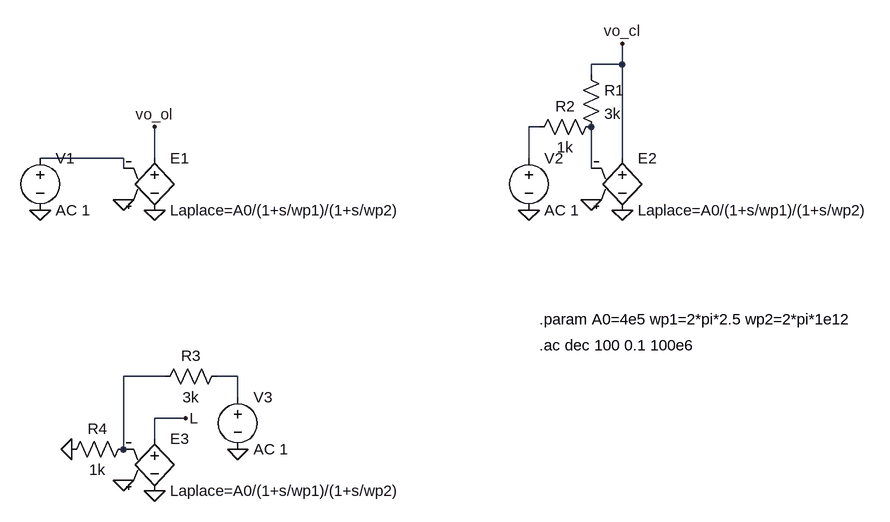
[diagram p0: schematic Draft5.asc]
Draft5.asc, the LTspice schematic file:
Version 4
SHEET 1 1644 896
WIRE 1232 224 1232 192
WIRE 1232 224 1184 224
WIRE 1184 240 1184 224
WIRE 1104 320 1088 320
WIRE 464 368 336 368
WIRE 512 368 512 320
WIRE 1088 368 1088 320
WIRE 1232 368 1232 224
WIRE 464 384 464 368
WIRE 1184 384 1184 320
WIRE 528 704 464 704
WIRE 640 704 608 704
WIRE 640 736 640 704
WIRE 560 768 512 768
WIRE 512 800 512 768
WIRE 464 816 464 704
FLAG 336 448 0
FLAG 464 432 0
FLAG 512 448 0
FLAG 512 320 vo_ol
FLAG 1232 192 vo_cl
FLAG 1088 448 0
FLAG 1184 432 0
FLAG 1232 448 0
FLAG 512 880 0
FLAG 464 864 0
FLAG 384 816 0
FLAG 560 768 L
FLAG 640 816 0
SYMBOL voltage 336 352 R0
SYMATTR InstName V1
SYMATTR Value AC 1
SYMBOL voltage 1088 352 R0
SYMATTR InstName V2
SYMATTR Value AC 1
SYMBOL voltage 640 720 R0
SYMATTR InstName V3
SYMATTR Value AC 1
SYMBOL e2 512 352 R0
SYMATTR InstName E1
SYMATTR Value Laplace=A0/(1+s/wp1)/(1+s/wp2)
SYMBOL e2 1232 352 R0
SYMATTR InstName E2
SYMATTR Value Laplace=A0/(1+s/wp1)/(1+s/wp2)
SYMBOL e2 512 784 R0
SYMATTR InstName E3
SYMATTR Value Laplace=A0/(1+s/wp1)/(1+s/wp2)
SYMBOL Res 1200 304 R90
WINDOW 0 0 56 VBottom 2
WINDOW 3 32 56 VTop 2
SYMATTR InstName R2
SYMATTR Value 1k
SYMBOL Res 1168 224 R0
SYMATTR InstName R1
SYMATTR Value 3k
SYMBOL Res 480 800 R90
WINDOW 0 0 56 VBottom 2
WINDOW 3 32 56 VTop 2
SYMATTR InstName R4
SYMATTR Value 1k
SYMBOL Res 624 688 R90
WINDOW 0 0 56 VBottom 2
WINDOW 3 32 56 VTop 2
SYMATTR InstName R3
SYMATTR Value 3k
TEXT 1104 616 Left 2 !.param A0=4e5 wp1=2*pi*2.5 wp2=2*pi*1e12
TEXT 1104 656 Left 2 !.ac dec 100 0.1 100e6

The netlist it stands for:
* Draft5.asc
V1 N002 0 AC 1
V2 N001 0 AC 1
V3 N005 0 AC 1
E1 vo_ol 0 0 N002 Laplace=A0/(1+s/wp1)/(1+s/wp2)
E2 vo_cl 0 0 N003 Laplace=A0/(1+s/wp1)/(1+s/wp2)
E3 L 0 0 N004 Laplace=A0/(1+s/wp1)/(1+s/wp2)
R2 N003 N001 1k
R1 vo_cl N003 3k
R4 N004 0 1k
R3 N005 N004 3k
.param A0=4e5 wp1=2*pi*2.5 wp2=2*pi*1e12
.ac dec 100 0.1 100e6
.backanno
.end